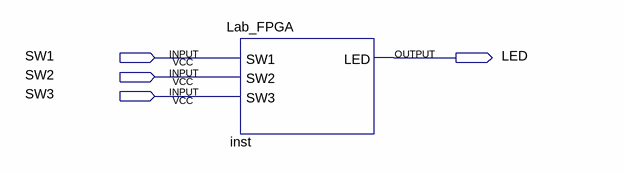
[diagram p0: schematic sheet]
// Quartus schematic Block1.bdf as structural Verilog: 1 symbols, 4 pins
module Block1 (
  input  SW1,
  input  SW2,
  input  SW3,
  output LED
);

  Lab_FPGA inst (.SW1(SW1), .SW2(SW2), .SW3(SW3), .LED(LED));
endmodule
